# Altium schematic sheet DVT-SerialBuffer.SchDoc: DVT Serial Buffer
size A4; PartNumber: PNxxx; Drawn By: Sebastian Kulik
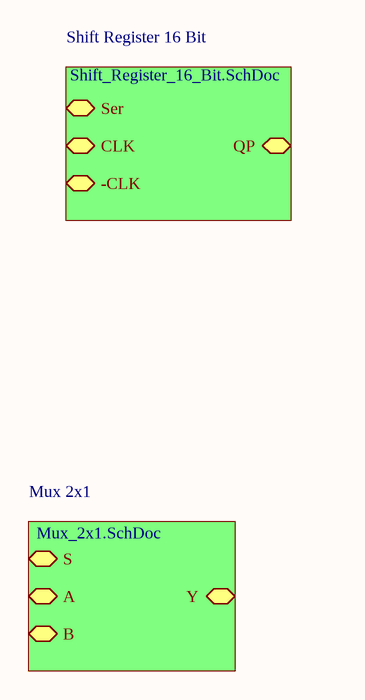
[diagram p0: DVT-SerialBuffer.SchDoc]

## Sub-sheets
Mux 2x1 = Mux_2x1.SchDoc: S, A, B, Y
Shift Register 16 Bit = Shift_Register_16_Bit.SchDoc: Ser, CLK, -CLK, QP

## Notes on the sheet
- Title
- Date
- Part Number
- Revision
- Sheet
- of
- Drawn By
- File